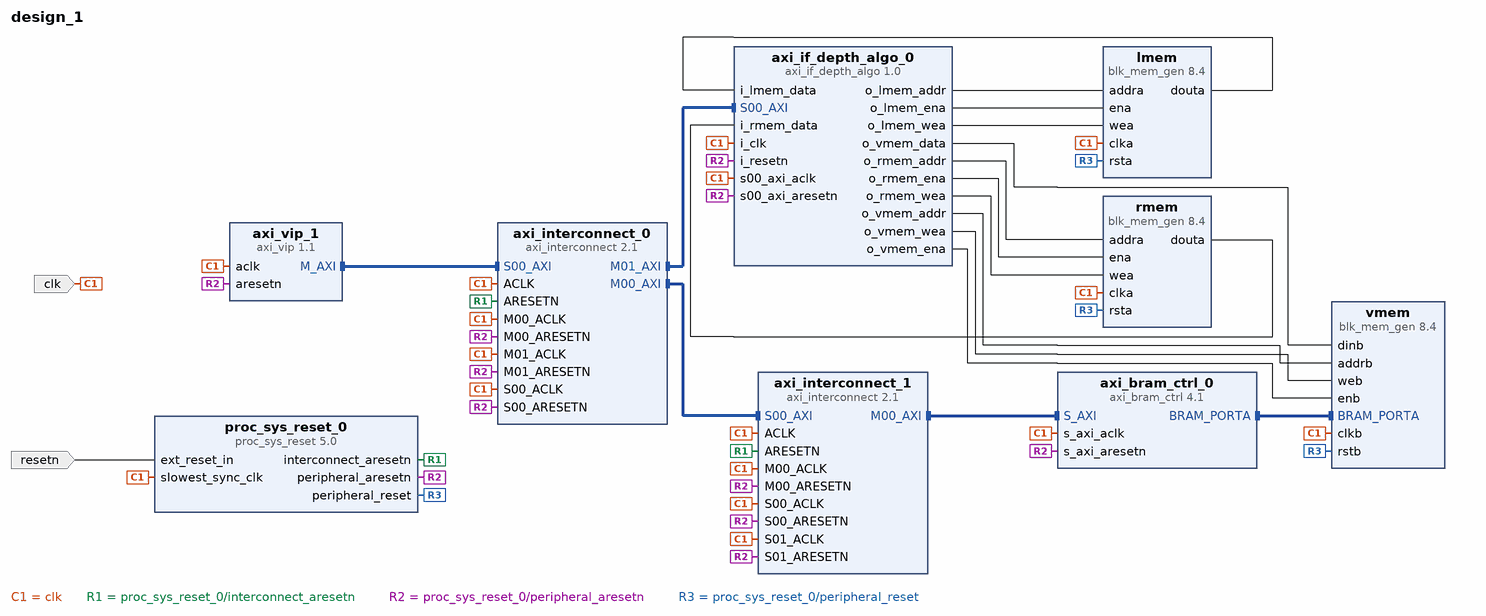
[diagram p0: block diagram of the top level]
# Vivado block design design_1, xc7a100tcsg324-1, Vivado 2018.3
create_bd_design design_1

create_bd_port -dir I -type clk clk
set_property -dict {CONFIG.FREQ_HZ 25000000} [get_bd_ports clk]
create_bd_port -dir I -type rst resetn

create_bd_cell -type ip -vlnv xilinx.com:ip:axi_vip:1.1 axi_vip_1
set_property -dict [list \
  CONFIG.ADDR_WIDTH 32 \
  CONFIG.DATA_WIDTH 32 \
  CONFIG.HAS_BRESP 1 \
  CONFIG.HAS_PROT 1 \
  CONFIG.HAS_RRESP 1 \
  CONFIG.HAS_WSTRB 1 \
  CONFIG.INTERFACE_MODE MASTER \
  CONFIG.PROTOCOL AXI4LITE \
  CONFIG.READ_WRITE_MODE READ_WRITE \
] [get_bd_cells axi_vip_1]
create_bd_cell -type ip -vlnv xilinx.com:ip:blk_mem_gen:8.4 vmem
set_property -dict [list \
  CONFIG.Enable_B Use_ENB_Pin \
  CONFIG.Memory_Type True_Dual_Port_RAM \
  CONFIG.Port_B_Clock 100 \
  CONFIG.Port_B_Enable_Rate 100 \
  CONFIG.Port_B_Write_Rate 50 \
  CONFIG.Use_RSTB_Pin true \
] [get_bd_cells vmem]
create_bd_cell -type ip -vlnv xilinx.com:ip:axi_bram_ctrl:4.1 axi_bram_ctrl_0
set_property -dict {CONFIG.PROTOCOL AXI4LITE CONFIG.SINGLE_PORT_BRAM 1} [get_bd_cells axi_bram_ctrl_0]
create_bd_cell -type ip -vlnv xilinx.com:ip:proc_sys_reset:5.0 proc_sys_reset_0
create_bd_cell -type ip -vlnv xilinx.com:ip:axi_interconnect:2.1 axi_interconnect_0
set_property -dict {CONFIG.NUM_MI 2 CONFIG.NUM_SI 1} [get_bd_cells axi_interconnect_0]
create_bd_cell -type ip -vlnv xilinx.com:ip:axi_interconnect:2.1 axi_interconnect_1
set_property -dict {CONFIG.NUM_MI 1 CONFIG.NUM_SI 2} [get_bd_cells axi_interconnect_1]
create_bd_cell -type ip -vlnv xilinx.com:user:axi_if_depth_algo:1.0 axi_if_depth_algo_0
create_bd_cell -type ip -vlnv xilinx.com:ip:blk_mem_gen:8.4 lmem
set_property -dict [list \
  CONFIG.Coe_File ../../../../../../im_left.coe \
  CONFIG.EN_SAFETY_CKT true \
  CONFIG.Enable_32bit_Address true \
  CONFIG.Load_Init_File true \
  CONFIG.Register_PortA_Output_of_Memory_Primitives true \
  CONFIG.Use_RSTA_Pin true \
  CONFIG.Write_Depth_A 8192 \
  CONFIG.use_bram_block Stand_Alone \
] [get_bd_cells lmem]
create_bd_cell -type ip -vlnv xilinx.com:ip:blk_mem_gen:8.4 rmem
set_property -dict [list \
  CONFIG.Coe_File ../../../../../../im_right.coe \
  CONFIG.EN_SAFETY_CKT true \
  CONFIG.Enable_32bit_Address true \
  CONFIG.Load_Init_File true \
  CONFIG.Register_PortA_Output_of_Memory_Primitives true \
  CONFIG.Use_RSTA_Pin true \
  CONFIG.Write_Depth_A 8192 \
  CONFIG.use_bram_block Stand_Alone \
] [get_bd_cells rmem]

# ---- connections ----

connect_bd_intf_net [get_bd_intf_pins axi_interconnect_0/M00_AXI] [get_bd_intf_pins axi_interconnect_1/S00_AXI]
connect_bd_intf_net [get_bd_intf_pins axi_interconnect_1/M00_AXI] [get_bd_intf_pins axi_bram_ctrl_0/S_AXI]
connect_bd_intf_net [get_bd_intf_pins axi_bram_ctrl_0/BRAM_PORTA] [get_bd_intf_pins vmem/BRAM_PORTA]
connect_bd_intf_net [get_bd_intf_pins axi_vip_1/M_AXI] [get_bd_intf_pins axi_interconnect_0/S00_AXI]
connect_bd_intf_net [get_bd_intf_pins axi_interconnect_0/M01_AXI] [get_bd_intf_pins axi_if_depth_algo_0/S00_AXI]
connect_bd_net [get_bd_ports clk] \
  [get_bd_pins axi_interconnect_0/ACLK] [get_bd_pins axi_interconnect_0/S00_ACLK] [get_bd_pins axi_interconnect_0/M00_ACLK] \
  [get_bd_pins axi_interconnect_0/M01_ACLK] [get_bd_pins axi_bram_ctrl_0/s_axi_aclk] [get_bd_pins axi_vip_1/aclk] \
  [get_bd_pins proc_sys_reset_0/slowest_sync_clk] [get_bd_pins axi_interconnect_1/S01_ACLK] \
  [get_bd_pins axi_interconnect_1/M00_ACLK] [get_bd_pins axi_interconnect_1/S00_ACLK] [get_bd_pins axi_interconnect_1/ACLK] \
  [get_bd_pins vmem/clkb] [get_bd_pins axi_if_depth_algo_0/i_clk] [get_bd_pins axi_if_depth_algo_0/s00_axi_aclk] \
  [get_bd_pins rmem/clka] [get_bd_pins lmem/clka]
connect_bd_net [get_bd_ports resetn] [get_bd_pins proc_sys_reset_0/ext_reset_in]
connect_bd_net [get_bd_pins proc_sys_reset_0/interconnect_aresetn] [get_bd_pins axi_interconnect_1/ARESETN] [get_bd_pins axi_interconnect_0/ARESETN]
connect_bd_net [get_bd_pins axi_if_depth_algo_0/o_vmem_data] [get_bd_pins vmem/dinb]
connect_bd_net [get_bd_pins axi_if_depth_algo_0/o_vmem_addr] [get_bd_pins vmem/addrb]
connect_bd_net [get_bd_pins axi_if_depth_algo_0/o_vmem_wea] [get_bd_pins vmem/web]
connect_bd_net [get_bd_pins axi_if_depth_algo_0/o_vmem_ena] [get_bd_pins vmem/enb]
connect_bd_net [get_bd_pins proc_sys_reset_0/peripheral_aresetn] \
  [get_bd_pins axi_bram_ctrl_0/s_axi_aresetn] [get_bd_pins axi_vip_1/aresetn] [get_bd_pins axi_interconnect_1/S01_ARESETN] \
  [get_bd_pins axi_interconnect_1/M00_ARESETN] [get_bd_pins axi_interconnect_1/S00_ARESETN] \
  [get_bd_pins axi_interconnect_0/M01_ARESETN] [get_bd_pins axi_interconnect_0/M00_ARESETN] \
  [get_bd_pins axi_interconnect_0/S00_ARESETN] [get_bd_pins axi_if_depth_algo_0/i_resetn] \
  [get_bd_pins axi_if_depth_algo_0/s00_axi_aresetn]
connect_bd_net [get_bd_pins proc_sys_reset_0/peripheral_reset] [get_bd_pins vmem/rstb] [get_bd_pins rmem/rsta] [get_bd_pins lmem/rsta]
connect_bd_net [get_bd_pins axi_if_depth_algo_0/o_rmem_addr] [get_bd_pins rmem/addra]
connect_bd_net [get_bd_pins rmem/douta] [get_bd_pins axi_if_depth_algo_0/i_rmem_data]
connect_bd_net [get_bd_pins axi_if_depth_algo_0/o_rmem_ena] [get_bd_pins rmem/ena]
connect_bd_net [get_bd_pins axi_if_depth_algo_0/o_rmem_wea] [get_bd_pins rmem/wea]
connect_bd_net [get_bd_pins axi_if_depth_algo_0/o_lmem_addr] [get_bd_pins lmem/addra]
connect_bd_net [get_bd_pins lmem/douta] [get_bd_pins axi_if_depth_algo_0/i_lmem_data]
connect_bd_net [get_bd_pins axi_if_depth_algo_0/o_lmem_ena] [get_bd_pins lmem/ena]
connect_bd_net [get_bd_pins axi_if_depth_algo_0/o_lmem_wea] [get_bd_pins lmem/wea]

# ---- address map ----
assign_bd_address -offset 0x00000000 -range 32K -target_address_space [get_bd_addr_spaces axi_vip_1/Master_AXI] [get_bd_addr_segs axi_bram_ctrl_0/S_AXI/Mem0]
assign_bd_address -offset 0x44A00000 -range 64K -target_address_space [get_bd_addr_spaces axi_vip_1/Master_AXI] [get_bd_addr_segs axi_if_depth_algo_0/S00_AXI/S00_AXI_reg]

validate_bd_design
save_bd_design
